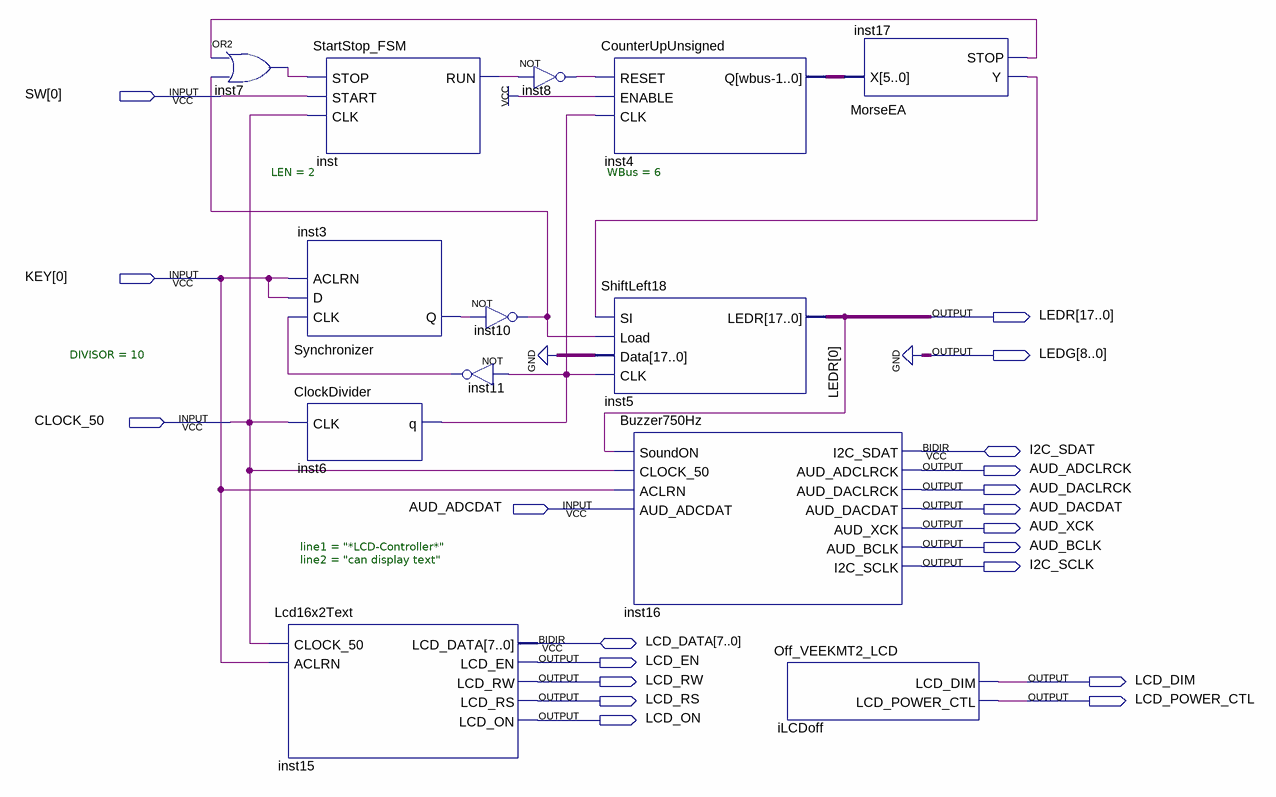
[diagram p0: schematic sheet]
// Quartus schematic morse.bdf as structural Verilog: 13 symbols, 20 pins
module morse (
  input  [0:0] SW,
  input  [0:0] KEY,
  input  CLOCK_50,
  input  AUD_ADCDAT,
  inout  I2C_SDAT,
  inout  [7:0] LCD_DATA,
  output [17:0] LEDR,
  output [8:0] LEDG,
  output AUD_ADCLRCK,
  output AUD_DACLRCK,
  output AUD_DACDAT,
  output AUD_XCK,
  output AUD_BCLK,
  output I2C_SCLK,
  output LCD_EN,
  output LCD_RW,
  output LCD_DIM,
  output LCD_RS,
  output LCD_POWER_CTL,
  output LCD_ON
);

  wire inst3_q, inst6_q, inst7_out, inst8_out, inst10_out, inst11_out, inst17_stop, inst17_y, inst_run;
  wire [5:0] inst4_q;

  or inst7 (inst7_out, inst17_stop, inst10_out);
  Synchronizer #(.LEN(2)) inst3 (.CLK(inst11_out), .D(KEY[0]), .ACLRN(KEY[0]), .Q(inst3_q));
  ClockDivider #(.DIVISOR(10)) inst6 (.CLK(CLOCK_50), .q(inst6_q));
  Lcd16x2Text #(.line1("*LCD-Controller*"), .line2("can display text")) inst15 (
    .CLOCK_50(CLOCK_50), .ACLRN(KEY[0]), .LCD_EN(LCD_EN), .LCD_RW(LCD_RW), .LCD_RS(LCD_RS), .LCD_ON(LCD_ON),
    .LCD_DATA(LCD_DATA));
  StartStop_FSM inst (.STOP(inst7_out), .START(SW[0]), .CLK(CLOCK_50), .RUN(inst_run));
  not inst8 (inst8_out, inst_run);
  not inst10 (inst10_out, inst3_q);
  not inst11 (inst11_out, inst6_q);
  CounterUpUnsigned #(.WBus(6)) inst4 (.RESET(inst8_out), .ENABLE(1'b1), .CLK(inst6_q), .Q(inst4_q));
  ShiftLeft18 inst5 (.SI(inst17_y), .Load(inst10_out), .Data({18{1'b0}}), .CLK(inst6_q), .LEDR(LEDR));
  Buzzer750Hz inst16 (
    .SoundON(LEDR[0]), .CLOCK_50(CLOCK_50), .ACLRN(KEY[0]), .AUD_ADCDAT(AUD_ADCDAT),
    .AUD_ADCLRCK(AUD_ADCLRCK), .AUD_DACLRCK(AUD_DACLRCK), .AUD_DACDAT(AUD_DACDAT), .AUD_XCK(AUD_XCK),
    .AUD_BCLK(AUD_BCLK), .I2C_SCLK(I2C_SCLK), .I2C_SDAT(I2C_SDAT));
  Off_VEEKMT2_LCD iLCDoff (.LCD_DIM(LCD_DIM), .LCD_POWER_CTL(LCD_POWER_CTL));
  MorseEA inst17 (.X(inst4_q), .Y(inst17_y), .STOP(inst17_stop));

  assign LEDG = {9{1'b0}};
endmodule
